# Altium schematic sheet Spannungsteiler.SchDoc
size A4; DocumentNumber: 1; Revision: 0.1; SheetNumber: 1; SheetTotal: 1; HTL_Gruppe: I; HTL_Klasse: Lehrkraft; HTL_Schueler_Name: Leopold Götsch; PageSetup: Record=PageOptions|CenterHorizontal=True|CenterVertical=True|PrintScale=1.00|XCorrection=1.00|YCorrection=1.00|PrintKind=0|BorderSize=5000000|LeftOffset=0|BottomOffset=0|Orientation=2|PaperLength=1000|PaperWidth=1000|Scale=100|PaperSource=7|PrintQuality=-4|MediaType=1|DitherType=10|PaperKind=A4|PrintScaleMode=1; HTL_Projektname: Projektname; HTL_Dokumentenart: Dokumentenart; HTL_Dokumentenstatus: Entwurf
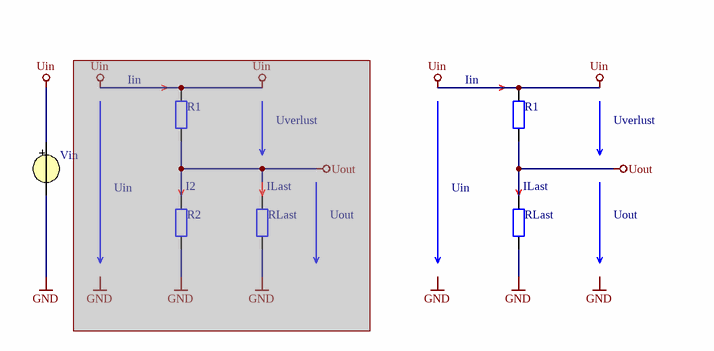
[diagram p0: Spannungsteiler.SchDoc]

## Parts
(Parts that share a designator on the sheet are numbered #1, #2 ... from top to bottom, then left to right.)
R1#1  1K  [R_0207/RM4]  (value not drawn)  (masked out: inside a compile mask, not in the netlist)
R1#2  1K  [R_0207/RM4]  (value not drawn)
R2  1K  [R_0207/RM4]  (value not drawn)  (masked out: inside a compile mask, not in the netlist)
RLast#1  1K  [R_0207/RM4]  (value not drawn)  (masked out: inside a compile mask, not in the netlist)
RLast#2  1K  [R_0207/RM4]  (value not drawn)
Vin  DC 10V  (value not drawn)

## Nets
GND: RLast#2.2 Vin.2
Uin: R1#2.1 Vin.1
Uout: R1#2.2 RLast#2.1

## Notes on the sheet
- (near R1#1) Iin
- (near R1#2) Iin
- Uverlust
- Uin
- (near R2) I2
- (near RLast#1) ILast
- Uout
- (near RLast#2) ILast
- Labels drawn without touching a wire or pin: GND
- Sachnummer / Dateiname:
- Name:
- Gruppe:
- Klasse:
- Titel:
- Datum:
- Dokumentenart:
- Dokumentenstatus:
- Ver.:
- Blatt:
- Blätter:

## Library data of the parts
R1#1 R1#2 R2 RLast#1 RLast#2 = R: Resistor; Usage: only permitted for non-commercial purposes at HTL I Innsbruck; Published: 21-Feb-2011; LatestRevisionDate: 07-Sep-2019; Value: 1K
Vin = VSRC: Voltage Source; Value: 10V